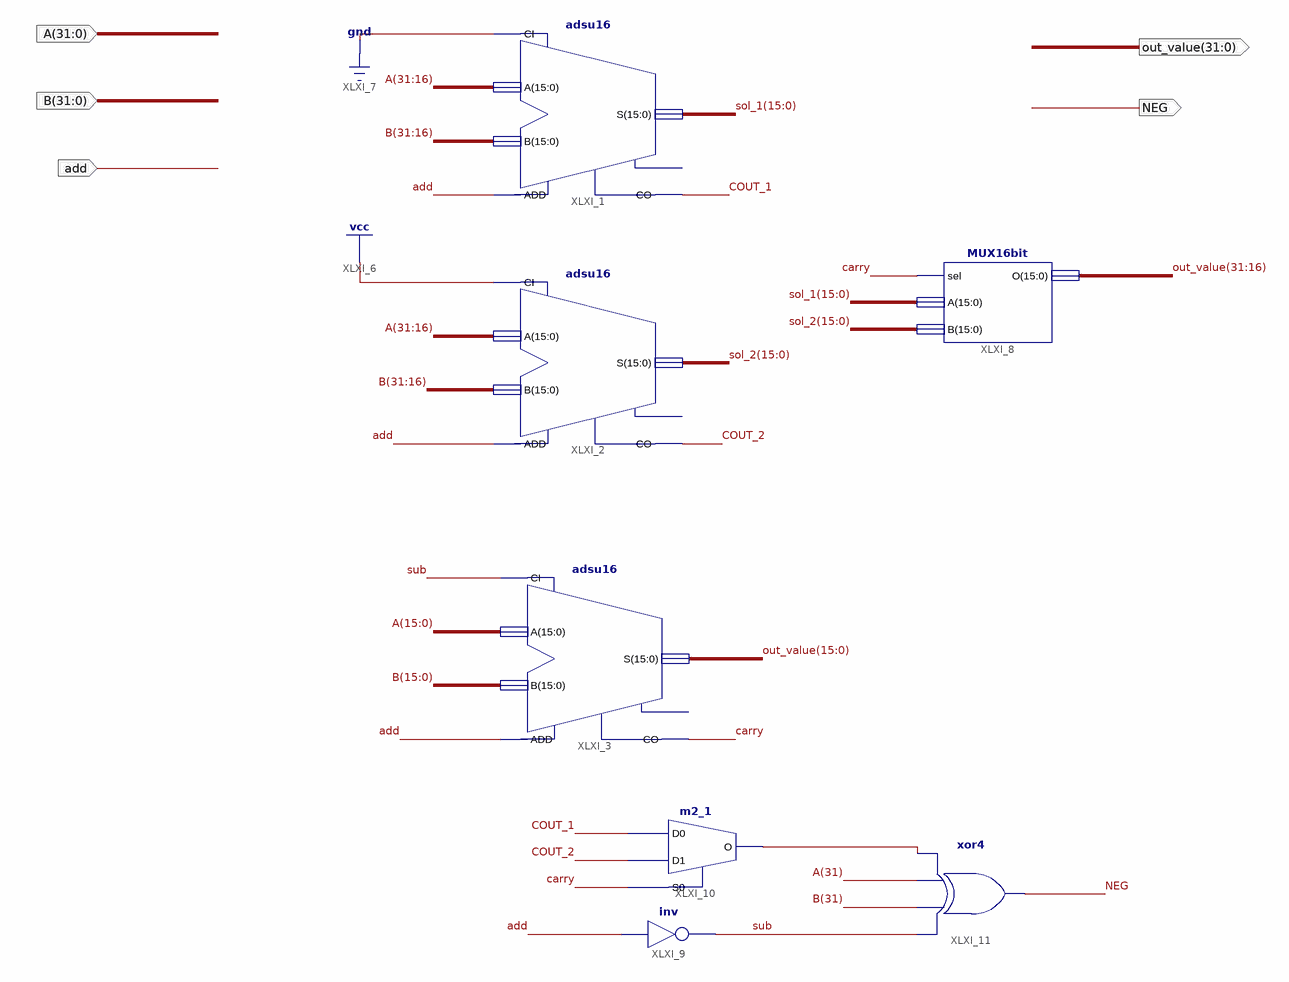
[diagram p0: schematic sheet 1]
// Xilinx ISE schematic cond_adder.sch (spartan6) as structural Verilog: 7 symbols, 5 ports
module cond_adder (
  input  add,
  input  [31:0] A,
  input  [31:0] B,
  output [31:0] out_value,
  output NEG
);

  wire carry, COUT_1, COUT_2, sub, XLXN_30;
  wire [15:0] sol_1, sol_2;

  adsu16 XLXI_1 (.A(A[31:16]), .ADD(add), .B(B[31:16]), .CI(1'b0), .CO(COUT_1), .S(sol_1));  // open: OFL
  adsu16 XLXI_2 (.A(A[31:16]), .ADD(add), .B(B[31:16]), .CI(1'b1), .CO(COUT_2), .S(sol_2));  // open: OFL
  adsu16 XLXI_3 (.A(A[15:0]), .ADD(add), .B(B[15:0]), .CI(sub), .CO(carry), .S(out_value[15:0]));  // open: OFL
  MUX16bit XLXI_8 (.sel(carry), .A(sol_1), .B(sol_2), .O(out_value[31:16]));
  m2_1 XLXI_10 (.D0(COUT_1), .D1(COUT_2), .S0(carry), .O(XLXN_30));
  xor XLXI_11 (NEG, sub, B[31], A[31], XLXN_30);
  not XLXI_9 (sub, add);
endmodule
